# EasyEDA Pro project PowerManager.eprj

# Schematic Schematic1
Create Date: 2024-06-30; Page Name: P1; Project Name: PowerManager; Schematic Name: Schematic1; Update Date: 2024-08-08; Company: 嘉立创EDA; Page Size: A4; Version: V1.0
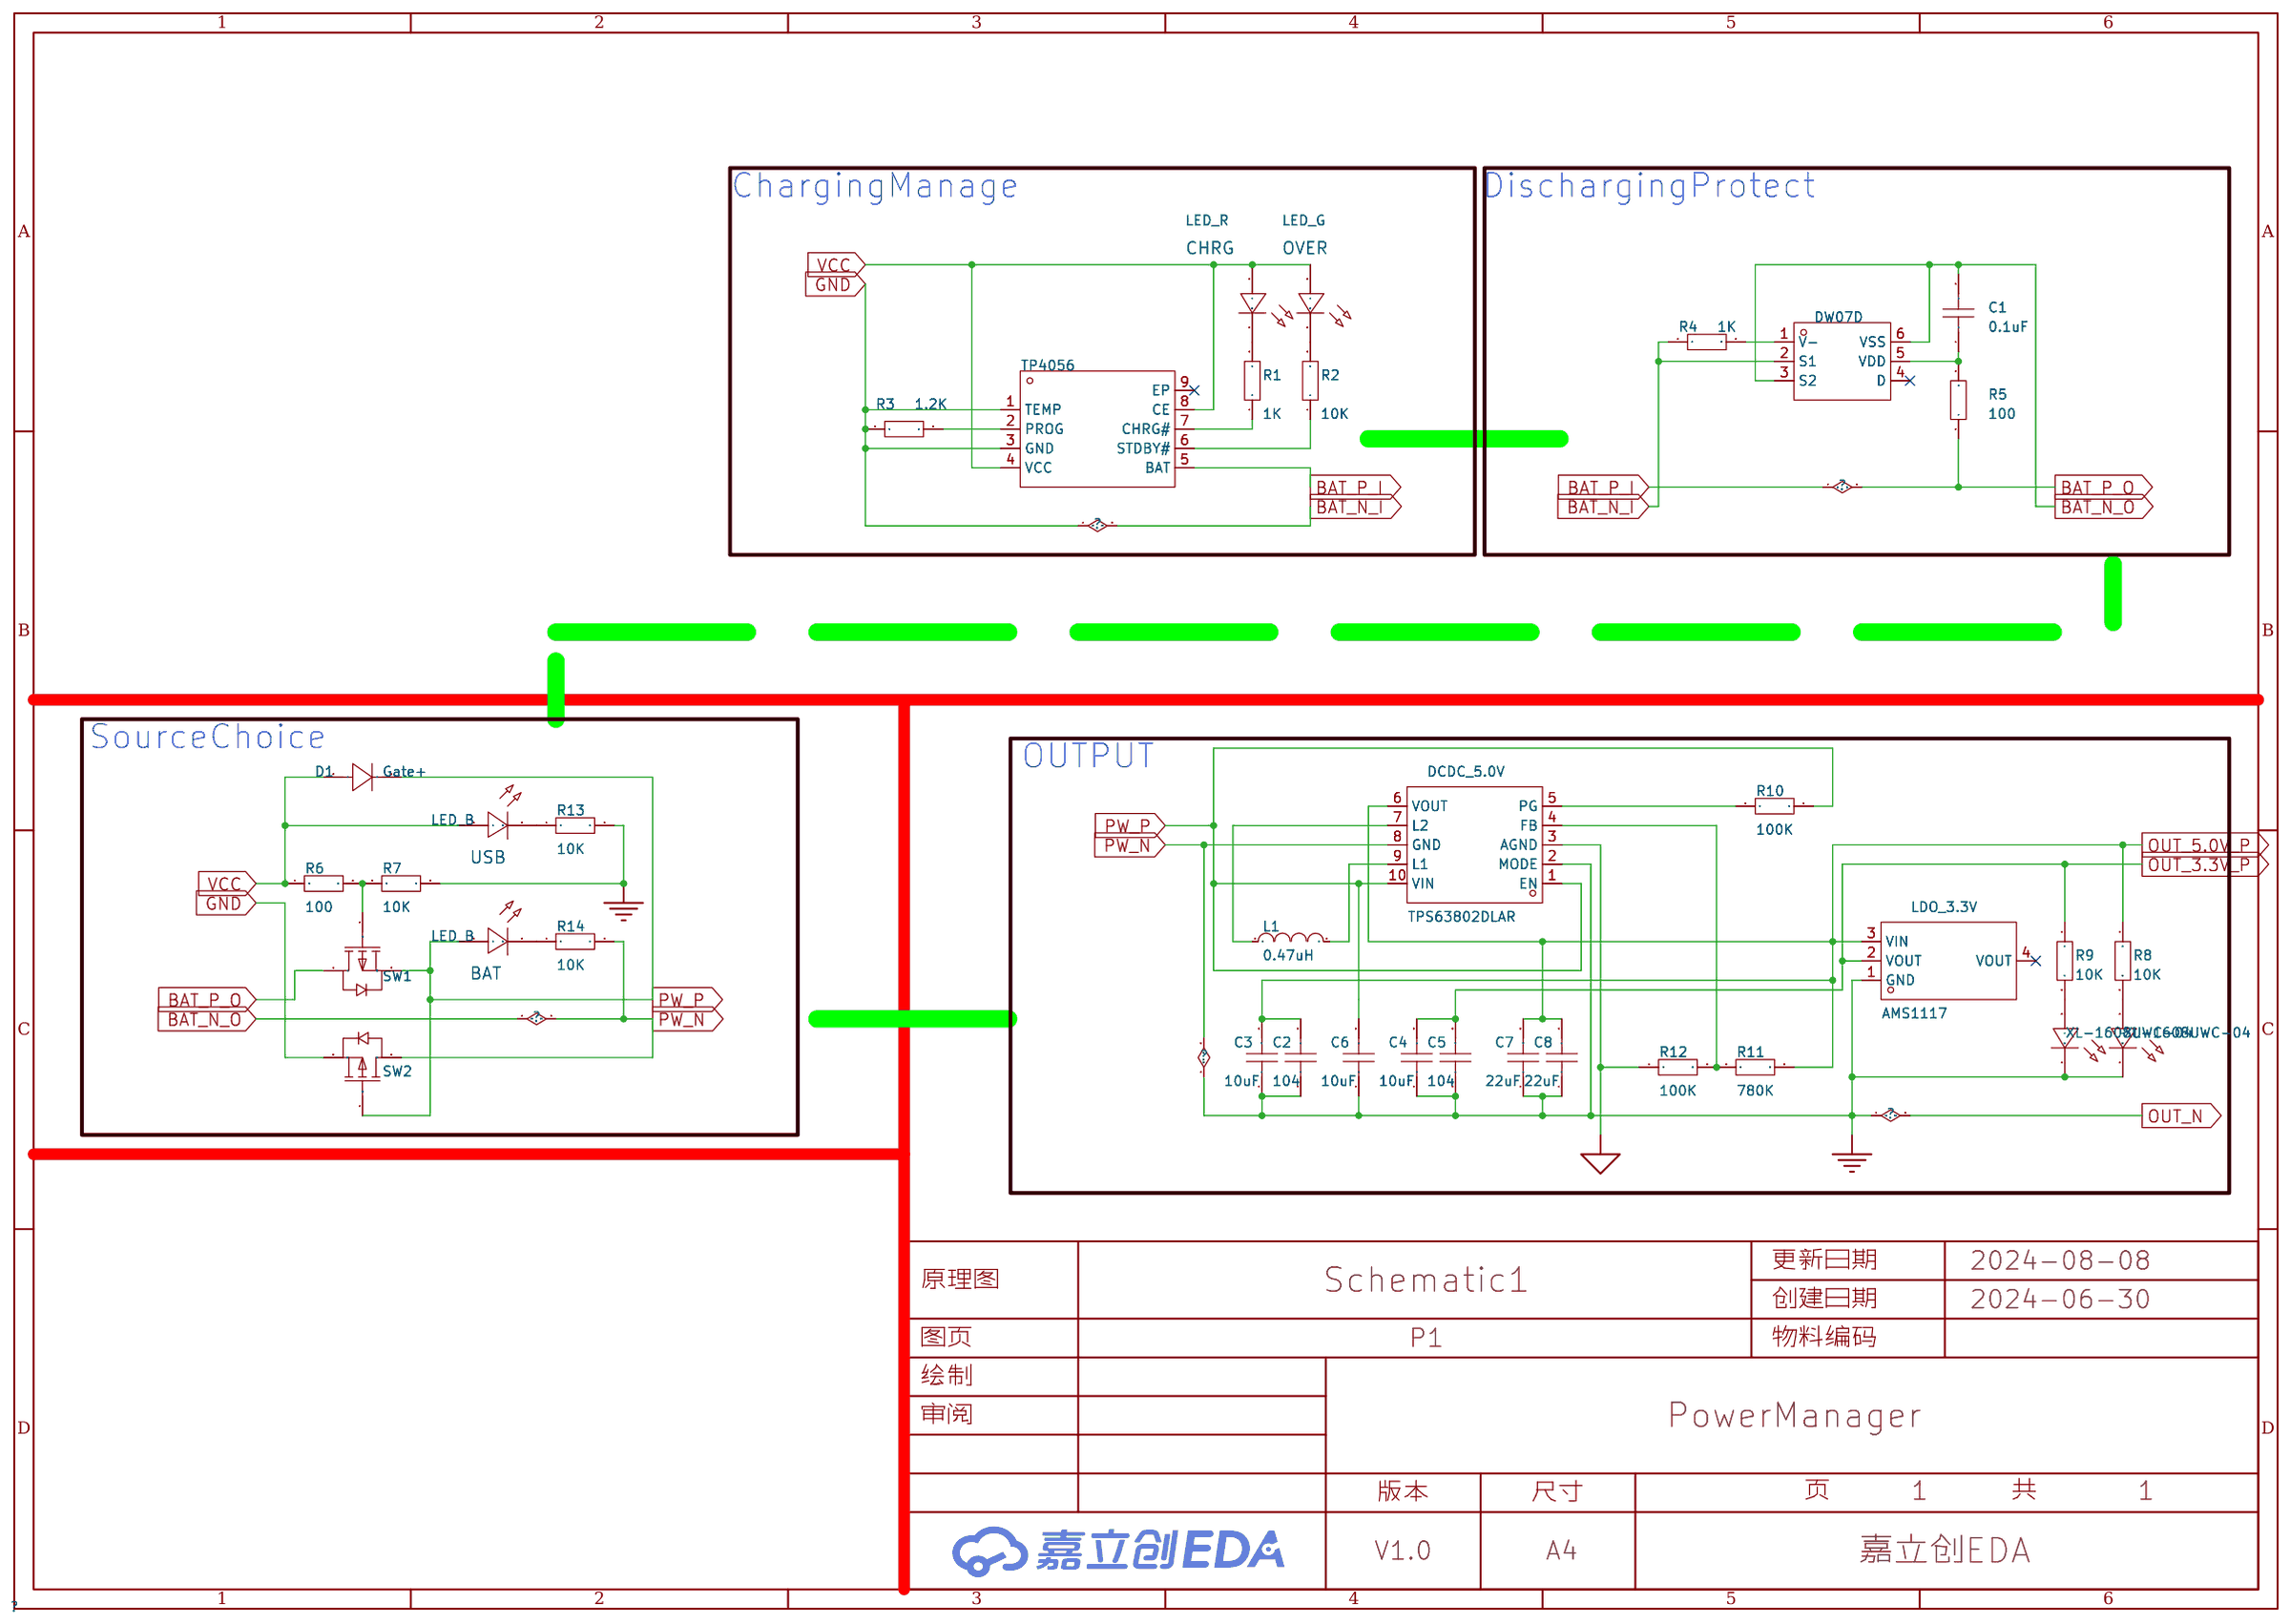
[diagram p0: schematic sheet]

## Parts
3.3V  XL-1608UWC-04  [LED0603-RD_WHITE]
5.0V  XL-1608UWC-04  [LED0603-RD_WHITE]
BAT  LED_B  [LED0603-RD_BLUE]
C1  0.1uF  [C0603]
C2  104  [C0603]
C3  10uF  [C0603]
C4  104  [C0603]
C5  10uF  [C0603]
C6  10uF  [C0603]
C7  22uF  [C0603]
C8  22uF  [C0603]
CHRG  LED_R  [LED_0603]
DCDC_5.0V  TPS63802DLAR  [VSON-10_L3.0-W2.0-P0.50-TL]
Gate+  D1  [SMA_1N4007]
L1  0.47uH  [L0603]
LDO_3.3V  AMS1117  [SOT-223-3_L6.5-W3.4-P2.30-LS7.0-BR]
OVER  LED_G  [LED0603-RD_GREEN]
R1  1K  [R0603]
R2  10K  [R0603]
R3  1.2K  [R0603]
R4  1K  [R0603]
R5  100  [R0603]
R6  100  [R0603]
R7  10K  [R0603]
R8  10K  [R0603]
R9  10K  [R0603]
R10  100K  [R0603]
R11  780K  [R0603]
R12  100K  [R0603]
R13  10K  [R0603]
R14  10K  [R0603]
SW1  AO3401A  [SOT-23_L2.9-W1.3-P1.90-LS2.4-BR]
SW2  AO3401A  [SOT-23_L2.9-W1.3-P1.90-LS2.4-BR]
TP4056  TP4056  [ESOP-8_L4.9-W3.9-P1.27-LS6.0-BL-EP]
U1  DW07D  [SOT-23-6_L2.9-W1.6-P0.95-LS2.8-BR]
USB  LED_B  [LED0603-RD_BLUE]

## Library data of the parts
3.3V 5.0V = XL-1608UWC-04: 发光颜色:白色;功率:80mW;正向电流:25mA;主波长:-;透镜颜色:黄色透镜;色温:13700K~19000K;发光角度:120°;载带方式:正贴;工作温度:-30℃~+85℃;; Supplier Part: C965808; Manufacturer: XINGLIGHT(成兴光); Supplier Footprint: 0603; JLCPCB Part Class: Extended Part; Datasheet: https://atta.szlcsc.com/upload/public/pdf/source/20221102/585FFDAF9A16AAB1CA7BDF9640D81A72.pdf; Supplier: LCSC; Emitted Color: 白色; Power Dissipation: 80mW; Forward Current: 25mA; Lens Color: 黄色透镜; Color Temperature: 13700K~19000K; Viewing Angle: 120°; Mounting Sytle: 正贴; Operating Temperature: -30℃~+85℃
BAT USB = XL-1608UBC-04: 发光颜色:蓝色;功率:80mW;正向电流:25mA;主波长:460nm~469nm;透镜颜色:无色透明透镜;色温:-;发光角度:120°;载带方式:正贴;工作温度:-30℃~+85℃;; Supplier Part: C965807; Manufacturer: XINGLIGHT(成兴光); Supplier Footprint: 0603; JLCPCB Part Class: Extended Part; Datasheet: https://atta.szlcsc.com/upload/public/pdf/source/20240218/F76B043D1CDACE9DB8357580572EF0D5.pdf; Supplier: LCSC; Emitted Color: 蓝色; Power Dissipation: 80mW; Forward Current: 25mA; Dominant Wavelength: 460nm~469nm; Peak Wavelength: 475nm; Lens Color: 无色透明透镜; Viewing Angle: 120°; Mounting Sytle: 正贴; Operating Temperature: -30℃~+85℃
C1-C8 = CAP_0603: Supplier Footprint: 0603
CHRG = LED_0603-R: Supplier Footprint: 0603
DCDC_5.0V = TPS63802DLAR_C2845237: Supplier Part: C2845237; Manufacturer: TI(德州仪器); Supplier Footprint: VSON-10(2x3); Datasheet: https://www.ti.com/cn/lit/gpn/tps63802; Supplier: LCSC
Gate+ = D_1N4007: Supplier Footprint: SMA
L1 = L_0603
LDO_3.3V = AMS1117-3.3_C6186: 输出类型:固定;最大输入电压:-;输出电压:3.3V;最大输出电流:1A;电源纹波抑制比(PSRR):72dB@(120Hz);输出极性:正极;; LCSC Part Name: 输出3.3V 1A; Supplier Part: C6186; Manufacturer: AMS; Supplier Footprint: SOT-223; Datasheet: https://atta.szlcsc.com/upload/public/pdf/source/20180727/C6186_7A095716F0823C02F1997A905E26C086.pdf; Supplier: LCSC; Output Type: 固定; Output Voltage: 3.3V; MAX Output Current: 1A; Power Supply Rejection Ratio (PSRR): 72dB@(120Hz); Dropout Voltage: 1.3V@(800mA); Output Polarity: 正极; Number of Outputs: 1
OVER = XL-1608UGC-04: 灯头类型:-;发光颜色:翠绿色;正向电压(VF):-;功率:80mW;正向电流:25mA;主波长:516nm~525nm;二极管配置:独立二极管;透镜颜色:无色透明透镜;色温:-;发光强度:-;发光角度:120°;载带方式:正贴;工作温度:-30℃~+85℃;; Supplier Part: C965804; Manufacturer: XINGLIGHT(成兴光); Manufacturer Part: LED_R; Supplier Footprint: 0603; JLCPCB Part Class: Extended Part; Datasheet: https://atta.szlcsc.com/upload/public/pdf/source/20221102/520D6E465E5CFD1609C8A4DBC80D4018.pdf; Supplier: LCSC; Emitted Color: 翠绿色; Power Dissipation: 80mW; Forward Current: 25mA; Dominant Wavelength: 516nm~525nm; Peak Wavelength: 534nm; Diode Configuration: 独立二极管; Lens Color: 无色透明透镜; Viewing Angle: 120°; Mounting Sytle: 正贴; Operating Temperature: -30℃~+85℃
R1-R14 = Res_0603: Supplier Footprint: 0603
SW1 SW2 = AO3401A_C15127: 类型:1个P沟道;漏源电压(Vdss):30V;连续漏极电流(Id):4A;功率(Pd):1.4W;导通电阻(RDS(on)@Vgs,Id):44mΩ@10V,4.3A;阈值电压(Vgs(th)@Id):1.3V@250uA;; LCSC Part Name: 1个P沟道 耐压:30V 电流:4A; Supplier Part: C15127; Manufacturer: AOS; Supplier Footprint: SOT-23; Datasheet: https://atta.szlcsc.com/upload/public/pdf/source/20160507/1462613609053.pdf; Supplier: LCSC; Type: 1个P沟道; Drain Source Voltage (Vdss): 30V; Continuous Drain Current (Id): 4A; Power Dissipation (Pd): 1.4W; Drain Source On Resistance (RDS(on)@Vgs,Id): 44mΩ@10V,4.3A; Gate Threshold Voltage (Vgs(th)@Id): 1.3V@250uA; Total Gate Charge (Qg@Vgs): 12.2nC@4.5V; Input Capacitance (Ciss@Vds): 1.2nF@15V; Operating Temperature: -55℃~+150℃@(Tj)
TP4056 = TP4056_C725790: Supplier Part: C725790; Manufacturer: UMW(友台半导体); Supplier Footprint: ESOP-8; Datasheet: https://atta.szlcsc.com/upload/public/pdf/source/20231109/CF74897CE79A500F7FE27A45ADCCC631.pdf; Supplier: LCSC
U1 = DW07D: 二合一锂电池保护IC; Supplier Part: C89497; Manufacturer: FM(富满); Supplier Footprint: SOT-23-6; Datasheet: https://atta.szlcsc.com/upload/public/pdf/source/20161128/1480332603746.pdf; Supplier: LCSC

## Nets
AGND: DCDC_5.0V.3(AGND) R12.1
DGND: 3.3V.1(C) 5.0V.1(C) C1.2 C2.1 C3.1 C4.1 C5.1 C6.1 C7.1 C8.1 DCDC_5.0V.2(MODE) DCDC_5.0V.8(GND) LDO_3.3V.1(GND) R14.2 SW2.3(D) U1.3(S2) U1.6(VSS)
GND: R3.1 R4.1 R7.2 R13.2 SW2.2(S) TP4056.1(TEMP) TP4056.3(GND) U1.2(S1)
VCC: CHRG.2(A) Gate+.2(A) OVER.2(A) R6.1 TP4056.4(VCC) TP4056.8(CE) USB.2(A)
BAT_P_I: R5.1 SW1.3(D) TP4056.5(BAT)
OUT_3.3V_P: C4.2 C5.2 LDO_3.3V.2(VOUT) R9.1
OUT_5.0V_P: C2.2 C3.2 C7.2 C8.2 DCDC_5.0V.6(VOUT) LDO_3.3V.3(VIN) R8.1 R11.2
PW_P: BAT.2(A) C6.2 DCDC_5.0V.1(EN) DCDC_5.0V.10(VIN) Gate+.1(K) R10.1 SW1.2(S) SW2.1(G)
$1N753: R3.2 TP4056.2(PROG)
$1N897: OVER.1(C) R2.2
$1N964: CHRG.1(C) R1.2
$1N968: R1.1 TP4056.7(CHRG#)
$1N975: R2.1 TP4056.6(STDBY#)
$1N1874: R6.2 R7.1 SW1.1(G)
$1N7526: 5.0V.2(A) R8.2
$1N7553: 3.3V.2(A) R9.2
$1N18992: R13.1 USB.1(C)
$1N19087: BAT.1(C) R14.1
Net-(C1-1): C1.1 R5.2 U1.5(VDD)
Net-(DCDC_5.0V-4): DCDC_5.0V.4(FB) R11.1 R12.2
Net-(DCDC_5.0V-5): DCDC_5.0V.5(PG) R10.2
Net-(DCDC_5.0V-7): DCDC_5.0V.7(L2) L1.1
Net-(DCDC_5.0V-9): DCDC_5.0V.9(L1) L1.2
Net-(R4-2): R4.2 U1.1(V-)

Not connected (* = marked no-connect by the designer): LDO_3.3V 4(VOUT)*; TP4056 9(EP)*; U1 4(D)*

## Notes on the sheet
- ChargingManage
- DischargingProtect
- SourceChoice
- OUTPUT

# Board PCB2
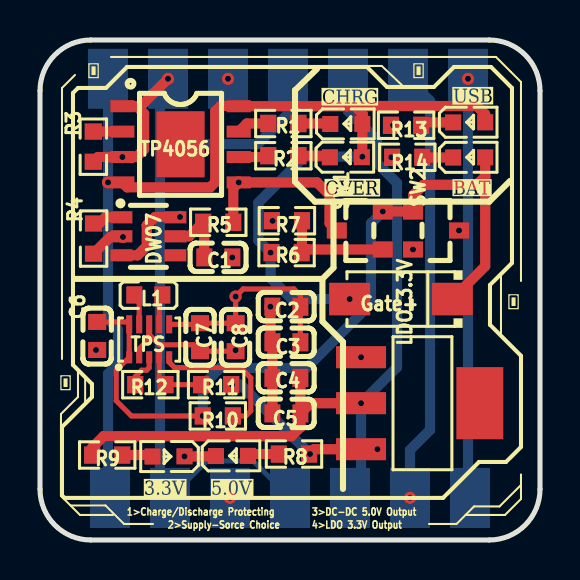
[diagram p1: board, top side]
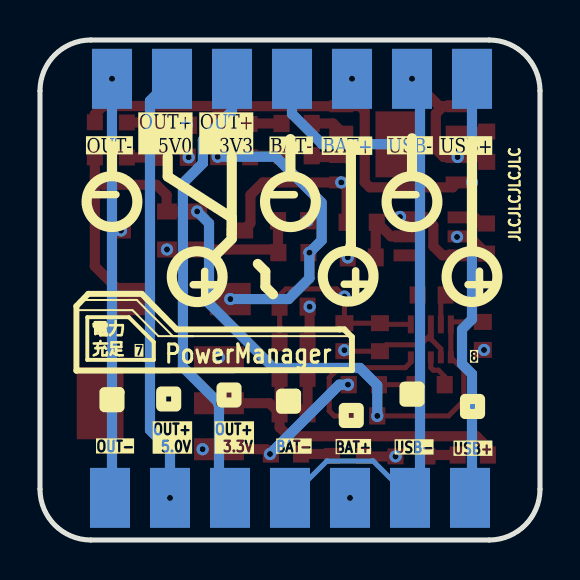
[diagram p2: board, bottom side, seen from below]

Outline 25 x 25 mm; copper layers: Top Layer, Inner1, Inner2, Bottom Layer. Coordinates in mm from the lower left corner of the outline.
Outline path: 0,22.46 0,2.54 arc(0.74,0.74) 2.54,0 22.46,0 arc(24.26,0.74) 25,2.54 25,22.46 arc(24.26,24.26) 22.46,25 2.54,25 arc(0.74,24.26) 0,22.46
Stack: Top Layer 0.035mm 外层铜厚1oz / Dielectric1 0.2104mm 7628 RC49% 8.6mil / Inner1 0.0152mm 内层铜厚 / Dielectric2 1.065mm 1.1mm H/HOZ 含铜 / Inner2 0.0152mm 内层铜厚 / Dielectric3 0.2104mm 7628 RC49% 8.6mil / Bottom Layer 0.035mm 外层铜厚1oz

## Design rules (mm)
template: 自定义配置
spacing copperThickness1oz (default): track to track 0.102, other pairs 0.152 to 0.3
spacing copperThickness2oz: track to track 0.203, other pairs 0.152 to 0.3
spacing copperThicknessInner0.5oz: track to track 0.089, other pairs 0.152 to 0.3
track width copperThickness1oz (default): min 0.102, default 0.254, max 2.54
track width copperThickness2oz: min 0.203, default 0.254, max 2.54
track width copperThickness0.5oz: min 0.089, default 0.254, max 2.54
differential pair differentialPair (default): width min 0.127, default 0.254, max 2.54; gap min 0.152, default 0.152
via viaSize (default): diameter min 0.3, default 0.61, max 10; hole min 0.2, default 0.305, max 6.3

## Placement (name value [footprint] x y rotation side)
3.3V  XL-1608UWC-04  [LED0603-RD_WHITE]  6.43 4.18 180 top
5.0V  XL-1608UWC-04  [LED0603-RD_WHITE]  9.6 4.2 0 top
BAT  LED_B  [LED0603-RD_BLUE]  21.46 19.13 0 top
C1  0.1uF  [C0603]  8.91 14.13 0 top
C2  104  [C0603]  12.32 11.67 0 top
C3  10uF  [C0603]  12.32 9.89 0 top
C4  104  [C0603]  12.32 8.11 0 top
C5  10uF  [C0603]  12.32 6.33 0 top
C6  10uF  [C0603]  2.86 10.2 90 top
C7  22uF  [C0603]  8 10.14 90 top
C8  22uF  [C0603]  9.78 10.14 90 top
CHRG  LED_R  [LED_0603]  15.37 20.81 0 top
DW07  DW07D  [SOT-23-6_L2.9-W1.6-P0.95-LS2.8-BR]  5.42 15.18 180 top
Gate+  D1  [SMA_1N4007]  18.05 12.05 180 top
L1  0.47uH  [L0603]  5.42 12.25 180 top
LDO_3.3V  AMS1117  [SOT-223-3_L6.5-W3.4-P2.30-LS7.0-BR]  19.02 6.84 180 top
NOREF  -  [Pad_e574]  9.5 2.11 0 top
NOREF#2  -  [Pad_e575]  12.5 2.11 0 top
NOREF#3  -  [Pad_e570]  18.4 23.06 0 top
NOREF#4  -  [Pad_e573]  6.5 2.11 0 top
NOREF#5  -  [Pad_e568]  12.4 23.06 0 top
NOREF#6  -  [Pad_e571]  21.4 23.06 0 top
NOREF#7  -  [Pad_e565]  3.4 23.06 0 top
NOREF#8  -  [Pad_e578]  21.5 2.11 0 top
NOREF#9  -  [Pad_e569]  15.4 23.06 0 top
NOREF#10  -  [Pad_e572]  3.5 2.11 0 top
NOREF#11  -  [Pad_e567]  9.4 23.06 0 top
NOREF#12  -  [Pad_e577]  18.5 2.11 0 top
NOREF#13  -  [Pad_e566]  6.4 23.06 0 top
NOREF#14  -  [Pad_e576]  15.5 2.11 0 top
OVER  LED_G  [LED0603-RD_GREEN]  15.29 19.14 0 top
R1  1K  [R0603]  12.17 20.83 0 top
R2  10K  [R0603]  12.17 19.21 0 top
R3  1.2K  [R0603]  2.67 19.67 90 top
R4  1K  [R0603]  2.68 15.07 90 top
R5  100  [R0603]  8.91 15.89 180 top
R6  100  [R0603]  12.33 14.37 0 top
R7  10K  [R0603]  12.35 15.96 180 top
R8  10K  [R0603]  12.7 4.3 180 top
R9  10K  [R0603]  3.36 4.25 0 top
R10  100K  [R0603]  8.89 6.2 0 top
R11  780K  [R0603]  8.81 7.77 0 top
R12  100K  [R0603]  5.52 7.77 0 top
R13  10K  [R0603]  18.3 20.74 180 top
R14  10K  [R0603]  18.36 19.13 180 top
SW1  AO3401A  [SOT-23_L2.9-W1.3-P1.90-LS2.4-BR]  15.99 15.48 0 top
SW2  AO3401A  [SOT-23_L2.9-W1.3-P1.90-LS2.4-BR]  19.8 15.48 180 top
TP4056  TP4056  [ESOP-8_L4.9-W3.9-P1.27-LS6.0-BL-EP]  7.03 19.78 270 top
TPS  TPS63802DLAR  [VSON-10_L3.0-W2.0-P0.50-TL]  5.46 9.96 90 top
USB  LED_B  [LED0603-RD_BLUE]  21.46 20.88 0 top

## Footprints (pads in the part's own frame, mm; a bottom-side part is the same pattern mirrored in y, then rotated)
C0603
  rect 0.8x0.9 smd: 1(-0.7,0) 2(0.7,0)
ESOP-8_L4.9-W3.9-P1.27-LS6.0-BL-EP
  rect 0.6x1.2 smd: 1(-1.905,-2.909) 2(-0.635,-2.909) 3(0.635,-2.909) 4(1.905,-2.909) 5(1.905,2.909) 6(0.635,2.909) 7(-0.635,2.909) 8(-1.905,2.909)
  rect 3.3x2.4 smd: 9(0,0)
L0603
  rect 0.8x0.864 smd: 1(-0.7,0) 2(0.7,0)
LED0603-RD_BLUE
  rect 0.8x0.8 smd: 1(-0.799,-0.004) 2(0.799,0.004)
LED0603-RD_GREEN
  rect 0.8x0.8 smd: 1(-0.799,-0.004) 2(0.799,0.004)
LED0603-RD_WHITE
  rect 0.8x0.8 smd: 1(-0.799,-0.004) 2(0.799,0.004)
LED_0603
  rect 0.8x0.8 smd: 1(-0.851,-0.01) 2(0.75,-0.005)
Pad_e565
  custom 2x3 smd far side: USB(0,0)
Pad_e566
  custom 2x3 smd far side: USB(0,0)
Pad_e567
  custom 2x3 smd far side: BAT(0,0)
Pad_e568
  custom 2x3 smd far side: BAT(0,0)
Pad_e569
  custom 2x3 smd far side: USB(0,0)
Pad_e570
  custom 2x3 smd far side: USB(0,0)
Pad_e571
  custom 2x3 smd far side: OUTN(0,0)
Pad_e572
  custom 2x3 smd far side: USB(0,0)
Pad_e573
  custom 2x3 smd far side: USB(0,0)
Pad_e574
  custom 2x3 smd far side: BAT(0,0)
Pad_e575
  custom 2x3 smd far side: BAT(0,0)
Pad_e576
  custom 2x3 smd far side: USB(0,0)
Pad_e577
  custom 2x3 smd far side: USB(0,0)
Pad_e578
  custom 2x3 smd far side: OUTN(0,0)
R0603
  rect 0.806x0.864 smd: 1(-0.753,0) 2(0.753,0)
SMA_1N4007
  rect 2.046x1.62 smd: 1(-2.566,0) 2(2.566,0)
SOT-23-6_L2.9-W1.6-P0.95-LS2.8-BR
  rect 1.1x0.6 smd: 1(1.35,-0.95) 2(1.35,0) 3(1.35,0.95) 4(-1.35,0.95) 5(-1.35,0) 6(-1.35,-0.95)
SOT-23_L2.9-W1.3-P1.90-LS2.4-BR
  rect 1x0.8 smd: 1(1.15,-0.95) 2(1.15,0.95) 3(-1.15,0)
SOT-223-3_L6.5-W3.4-P2.30-LS7.0-BR
  rect 2.5x1.1 smd: 1(2.97,-2.3) 2(2.97,0) 3(2.97,2.3)
  rect 2.34x3.6 smd: 4(-2.97,0)
VSON-10_L3.0-W2.0-P0.50-TL
  rect 0.6x0.3 smd: 1(-0.825,1) 2(-0.825,0.5) 3(-0.825,0) 4(-0.825,-0.5) 5(-0.825,-1)
  rect 0.9x0.3 smd: 6(0.825,-1) 7(0.825,-0.5) 9(0.825,0.5) 10(0.825,1)
  rect 1.3x0.3 smd: 8(0.625,0)

## Nets
AGND: R12.1 TPS.3
DGND: 3.3V.1 5.0V.1 C1.2 C2.1 C3.1 C4.1 C5.1 C6.1 C7.1 C8.1 DW07.3 DW07.6 LDO_3.3V.1 NOREF#6.OUTN NOREF#8.OUTN R14.2 SW2.3 TPS.2 TPS.8
GND: DW07.2 NOREF#2.BAT NOREF#4.USB NOREF#5.BAT NOREF#13.USB R3.1 R4.1 R7.2 R13.2 SW2.2 TP4056.1 TP4056.3
VCC: CHRG.2 Gate+.2 NOREF#7.USB NOREF#10.USB OVER.2 R6.1 TP4056.4 TP4056.8 USB.2
BAT_P_I: NOREF.BAT NOREF#11.BAT R5.1 SW1.3 TP4056.5
OUT_3.3V_P: C4.2 C5.2 LDO_3.3V.2 NOREF#9.USB NOREF#14.USB R9.1
OUT_5.0V_P: C2.2 C3.2 C7.2 C8.2 LDO_3.3V.3 NOREF#3.USB NOREF#12.USB R8.1 R11.2 TPS.6
PW_P: BAT.2 C6.2 Gate+.1 R10.1 SW1.2 SW2.1 TPS.1 TPS.10
$1N753: R3.2 TP4056.2
$1N897: OVER.1 R2.2
$1N964: CHRG.1 R1.2
$1N968: R1.1 TP4056.7
$1N975: R2.1 TP4056.6
$1N1874: R6.2 R7.1 SW1.1
$1N7526: 5.0V.2 R8.2
$1N7553: 3.3V.2 R9.2
$1N8307: DW07.1 R4.2
$1N8437: C1.1 DW07.5 R5.2
$1N9793: L1.2 TPS.9
$1N9797: L1.1 TPS.7
$1N10563: R10.2 TPS.5
$1N11159: R11.1 R12.2 TPS.4
$1N18992: R13.1 USB.1
$1N19087: BAT.1 R14.1

Pads without a net: DW07 4; LDO_3.3V 4; TP4056 9

## Via types
v1: diameter 0.61, hole 0.305, Top Layer to Bottom Layer, 31 vias

## Routing (per net, layer and track width the routed paths; a pad name or vN(x,y) marks a point on that pad's centre or on a via; arc(x,y) is an arc through that point)
AGND: length 1.8
  Top Layer w0.254: TPS.3 5.46,8.61 5.33,8.49 5.08,8.49 4.76,8.17 R12.1
DGND: length 85.4
  Top Layer w0.254: 5.46,10.27 5.46,10.06 4.96,9.56 TPS.2 ; 5.46,10.27 5.97,9.76 7.68,9.76 C7.1 C8.1 ; 5.46,10.27 TPS.8
  Top Layer w0.508: v1(11.52,11.67) 11.52,9.99 C3.1 C4.1 C5.1 ; DW07.3 4.87,14.23 5.33,14.69 5.33,15.73 5.76,16.15 v1(7,16.15) ; v1(7.22,4.18) 8.73,4.18 8.78,4.23
  Inner2 w0.508: v1(7,16.15) 9.02,14.13 v1(9.61,14.13) 10.49,14.13 11.43,13.19 11.43,11.75 v1(11.52,11.67) ; 7.22,7.37 9.34,9.49 ; 7.22,7.37 v1(7.22,4.18) ; 7.22,7.37 7.2,7.35 4.95,7.35 v1(2.8,9.5) ; 9.34,9.49 v1(11.52,11.67) ; 9.34,9.49 v1(9.78,9.49) ; v1(11.52,11.67) 13.53,11.67 v1(16.05,9.14) 20.95,14.04 v1(20.95,15.48) 20.95,15.75 v1(17.57,19.13) 21.4,22.97 v1(21.4,23.06)
  Bottom Layer w0.508: v1(21.4,23.06) 21.4,2.21 NOREF#8.OUTN
GND: length 81
  Top Layer w0.508: R4.1 3.51,15.15 v1(4.15,15.15) ; 4.84,21.69 5.21,21.32 5.21,19.54 4.82,19.15 v1(4.12,19.15) 2.9,19.15 R3.1 ; 4.84,21.69 TP4056.1 ; 4.84,21.69 5.03,21.69 v1(6.4,23.06)
  Inner1 w0.508: 18.65,14.59 18.07,14 12.95,14 11.63,15.32 v1(11.63,15.96) ; 18.65,14.59 18.65,19.74 v1(17.65,20.74) 5.71,20.74 v1(4.12,19.15) 4.58,18.69 4.58,15.58 v1(4.15,15.15) ; 18.65,14.59 v1(18.65,14.53)
  Bottom Layer w0.25: NOREF#2.BAT 10.66,3.95 8.34,3.95 NOREF#4.USB
  Bottom Layer w0.508: 6,19.79 6,2.61 NOREF#4.USB ; 6,19.79 10.89,19.79 12.4,21.31 NOREF#5.BAT ; 6,19.79 6,22.66 v1(6.4,23.06)
VCC: length 62.4
  Top Layer w0.508: USB.2 22.26,21.28 21.84,21.7 15.34,21.7 15.33,21.69 ; v1(3.4,17.88) TP4056.4 4.36,17.63 8.51,17.63 8.76,17.89 8.76,21.44 9.02,21.7 9.93,21.7 TP4056.8 15.33,21.69 ; 15.33,21.69 15.76,21.69 16.13,21.32 16.13,20.82 CHRG.2 v1(16.12,19.16) OVER.2
  Bottom Layer w0.508: v1(16.12,19.16) 13.21,19.16 10.92,16.87 10.92,14.98 v1(11.53,14.37) 11.53,13.09 12.57,12.05 v1(15.48,12.05) ; NOREF#7.USB v1(3.4,17.88) 3.4,11.03 3.9,10.53 3.9,8.8 3.4,8.3 3.4,2.21 NOREF#10.USB
BAT_P_I: length 41.2
  Top Layer w0.508: R5.1 9.67,17.61 v1(9.94,17.88) 13.85,17.88 14.48,17.25 14.48,15.84 SW1.3
  Inner2 w0.508: v1(9.5,2.11) 6.04,2.11 1.65,6.5 1.65,13.8 5.75,17.9 9.91,17.9 v1(9.94,17.88) 9.94,22.52 v1(9.4,23.06)
OUT_3.3V_P: length 39.9
  Top Layer w0.508: R9.1 2.61,4.62 3.18,5.19 12.57,5.19 13.02,5.63 C5.2 ; v1(16.05,6.84) 13.53,6.84 C5.2 ; C4.2 C5.2
  Bottom Layer w0.25: NOREF#14.USB 16.05,2.66
  Bottom Layer w0.508: 16.05,2.66 v1(16.05,6.84) 17.85,8.64 17.85,17.84 16.85,18.84 16.85,20 15.4,21.45 NOREF#9.USB
OUT_5.0V_P: length 49.7
  Top Layer w0.254: 6.46,10.78 7.94,10.78 C7.2 C8.2 v1(9.78,12.17) 10.16,12.55 12.7,12.55 13.02,12.23 C2.2 C3.2
  Top Layer w0.508: v1(16.87,4.54) 13.69,4.54 R8.1
  Inner1 w0.508: v1(9.78,12.17) 8.76,11.16 8.76,8.24 9.23,7.77 v1(9.6,7.77)
  Inner2 w0.508: v1(18.5,2.11) 18.5,2.91 v1(16.87,4.54)
  Bottom Layer w0.508: NOREF#3.USB 19.5,21.96 19.5,5.5 18.5,4.5 v1(18.5,2.11) ; v1(9.6,7.77) 10.03,7.77 v1(13.5,4.3)
PW_P: length 40.9
  Top Layer w0.254: v1(8.14,6.2) 4.57,6.2 3.81,6.97 3.81,8.48 TPS.1 4.46,10.78 4.34,10.9 C6.2
  Top Layer w0.508: 22.26,18.18 22.26,13.69 Gate+.1 ; 22.26,18.18 BAT.2 ; 22.26,18.18 21.84,17.76 19.18,17.76 18.67,17.25 18.67,16.44 SW2.1 v1(17.14,16.43)
  Bottom Layer w0.508: v1(8.14,6.2) 8.14,7.74 9,8.6 13.32,8.6 16.55,11.83 16.55,15.83 v1(17.14,16.43)
$1N753: length 1.5
  Top Layer w0.508: R3.2 TP4056.2
$1N897: length 1.6
  Top Layer w0.508: R2.2 14.41,19.21 OVER.1
$1N964: length 1.6
  Top Layer w0.508: CHRG.1 14.49,20.83 R1.2
$1N968: length 1.6
  Top Layer w0.508: TP4056.7 10.34,20.83 R1.1
$1N975: length 1.5
  Top Layer w0.508: TP4056.6 11.35,19.15 R2.1
$1N1874: length 5.7
  Top Layer w0.508: 13.1,14.39 R6.2 ; 13.1,14.39 R7.1 ; 13.1,14.39 13.24,14.53 SW1.1
$1N7526: length 1.6
  Top Layer w0.508: 10.38,4.23 10.44,4.3 R8.2
$1N7553: length 1.5
  Top Layer w0.508: R9.2 5.55,4.25 3.3V.2
$1N8307: length 1.5
  Top Layer w0.508: R4.2 2.96,15.83 3.27,16.13 DW07.1
$1N8437: length 3.5
  Top Layer w0.508: C1.1 8.21,15.83 R5.2 7.46,15.18 DW07.5
$1N9793: length 1.6
  Top Layer w0.254: L1.2 4.96,12.01 4.96,10.78
$1N9797: length 1.5
  Top Layer w0.254: L1.1 5.96,12.09 5.96,10.78
$1N10563: length 7.3
  Top Layer w0.254: TPS.5 6.46,8.89 6.73,8.62 10.03,8.62 10.54,8.11 10.54,6.46 10.29,6.2 R10.2
$1N11159: length 3.3
  Top Layer w0.254: R11.1 R12.2 5.96,8.08 TPS.4
$1N18992: length 1.7
  Top Layer w0.508: USB.1 19.2,20.88 R13.1
$1N19087: length 1.5
  Top Layer w0.508: BAT.1 19.12,19.12 R14.1

## Copper pours and planes (outline as drawn; the poured copper is in the pictures)
DGND on Top Layer: -2.41,25.99 27.82,25.99 27.82,-1.57 -2.41,-1.57
DGND on Bottom Layer: 16.95,28.3 29.5,28.3 29.5,-2.6 16.95,-2.6
DGND on Inner2: -12.76,33.72 34.49,33.72 34.49,-9.34 -12.76,-9.34
GND on Inner1: -6.68,29.54 33.19,29.54 33.19,-5.51 -6.68,-5.51
VCC on Bottom Layer: -4,-2.65 -4,28.29 16.7,28.29 16.7,-2.65
OUT_5.0V_P on Bottom Layer: 9.6,7.82 13.5,7.82 13.5,4.35 9.6,4.35
PW_P on Bottom Layer: 8.04,17.44 18.55,17.44 18.55,6.25 8.04,6.25

## Text on the board
Bottom Silkscreen Layer: 8 | 7 | USB+ | USB- | BAT+ | BAT- | OUT+ / 3.3V | OUT+ / 5.0V | OUT- | JLCJLCJLCJLC | PowerManager | - | + | 電力 / 充足 | OUT+ / 3V3 | OUT+ / 5V0
Top Silkscreen Layer: 1>Charge/Discharge Protecting | 2>Supply-Sorce Choice | 3>DC-DC 5.0V Output | 4>LDO 3.3V Output | ③ | ① | ② | ④
